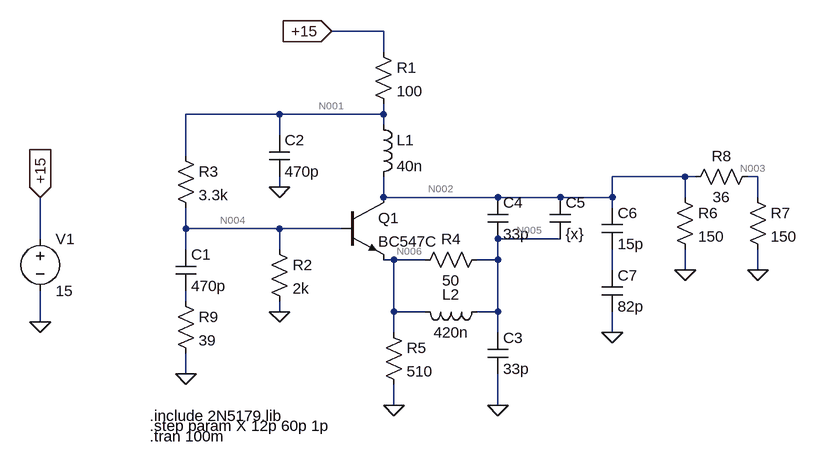
[diagram p0: schematic 2ndmixer-2ndlo.asc]
2ndmixer-2ndlo.asc, the LTspice schematic file:
Version 4
SHEET 1 880 680
WIRE 128 -144 48 -144
WIRE 128 -112 128 -144
WIRE -32 -16 -176 -16
WIRE 128 -16 128 -32
WIRE 128 -16 -32 -16
WIRE 128 0 128 -16
WIRE -32 16 -32 -16
WIRE -176 48 -176 -16
WIRE 592 80 480 80
WIRE 608 80 592 80
WIRE 704 80 688 80
WIRE -32 96 -32 80
WIRE 128 112 128 80
WIRE 304 112 128 112
WIRE 400 112 304 112
WIRE 480 112 480 80
WIRE 480 112 400 112
WIRE 592 112 592 80
WIRE 704 112 704 80
WIRE 480 128 480 112
WIRE -176 160 -176 128
WIRE -32 160 -176 160
WIRE 64 160 -32 160
WIRE -400 176 -400 112
WIRE 400 176 304 176
WIRE -176 192 -176 160
WIRE -32 192 -32 160
WIRE 144 208 128 208
WIRE 192 208 144 208
WIRE 304 208 304 176
WIRE 304 208 272 208
WIRE 480 224 480 192
WIRE 592 224 592 192
WIRE 704 224 704 192
WIRE -176 272 -176 256
WIRE -32 288 -32 272
WIRE 144 288 144 208
WIRE 192 288 144 288
WIRE 304 288 304 208
WIRE 304 288 272 288
WIRE -400 304 -400 256
WIRE 144 320 144 288
WIRE 304 320 304 288
WIRE 480 320 480 288
WIRE -176 384 -176 352
WIRE 144 432 144 400
WIRE 304 432 304 384
FLAG 48 -144 +15
IOPIN 48 -144 In
FLAG -400 112 +15
IOPIN -400 112 In
FLAG -400 304 0
FLAG -32 288 0
FLAG 144 432 0
FLAG 304 432 0
FLAG 480 320 0
FLAG -32 96 0
FLAG 592 224 0
FLAG 704 224 0
FLAG -176 384 0
SYMBOL npn 64 112 R0
SYMATTR InstName Q1
SYMATTR Value BC547C
SYMBOL ind 112 -16 R0
SYMATTR InstName L1
SYMATTR Value 40n
SYMBOL res 112 -128 R0
SYMATTR InstName R1
SYMATTR Value 100
SYMBOL voltage -400 160 R0
WINDOW 123 0 0 Left 0
WINDOW 39 0 0 Left 0
SYMATTR InstName V1
SYMATTR Value 15
SYMBOL res -48 176 R0
SYMATTR InstName R2
SYMATTR Value 2k
SYMBOL res -192 32 R0
SYMATTR InstName R3
SYMATTR Value 3.3k
SYMBOL cap -192 192 R0
SYMATTR InstName C1
SYMATTR Value 470p
SYMBOL cap -48 16 R0
SYMATTR InstName C2
SYMATTR Value 470p
SYMBOL ind 288 272 R90
WINDOW 0 5 56 VBottom 2
WINDOW 3 32 56 VTop 2
SYMATTR InstName L2
SYMATTR Value 420n
SYMBOL res 128 304 R0
SYMATTR InstName R5
SYMATTR Value 510
SYMBOL cap 288 320 R0
SYMATTR InstName C3
SYMATTR Value 33p
SYMBOL cap 288 112 R0
SYMATTR InstName C4
SYMATTR Value 33p
SYMBOL cap 384 112 R0
SYMATTR InstName C5
SYMATTR Value {x}
SYMBOL cap 464 128 R0
SYMATTR InstName C6
SYMATTR Value 15p
SYMBOL cap 464 224 R0
SYMATTR InstName C7
SYMATTR Value 82p
SYMBOL res 576 96 R0
SYMATTR InstName R6
SYMATTR Value 150
SYMBOL res 688 96 R0
SYMATTR InstName R7
SYMATTR Value 150
SYMBOL res 704 64 R90
WINDOW 0 0 56 VBottom 2
WINDOW 3 32 56 VTop 2
SYMATTR InstName R8
SYMATTR Value 36
SYMBOL res -192 256 R0
SYMATTR InstName R9
SYMATTR Value 39
SYMBOL res 288 192 R90
WINDOW 0 0 56 VBottom 2
WINDOW 3 32 56 VTop 2
SYMATTR InstName R4
SYMATTR Value 50
TEXT -232 448 Left 2 !.include 2N5179.lib
TEXT -232 480 Left 2 !.tran 100m
TEXT -232 464 Left 2 !.step param X 12p 60p 1p

The netlist it stands for:
* 2ndmixer-2ndlo.asc
Q1 N002 N004 N006 0 BC547C
L1 N001 N002 40n
R1 +15 N001 100
V1 +15 0 15
R2 N004 0 2k
R3 N001 N004 3.3k
C1 N004 N008 470p
C2 N001 0 470p
L2 N005 N006 420n
R5 N006 0 510
C3 N005 0 33p
C4 N002 N005 33p
C5 N002 N005 {x}
C6 N002 N007 15p
C7 N007 0 82p
R6 N002 0 150
R7 N003 0 150
R8 N003 N002 36
R9 N008 0 39
R4 N005 N006 50
.model NPN NPN
.model PNP PNP
.lib standard.bjt
.include 2N5179.lib
.tran 100m
.step param X 12p 60p 1p
.backanno
.end

* Results of the author's LTspice run, read from the files saved beside the schematic
* Operating Point (first step), zero values left out:
*   x = 12 p
*   V(n002) = 6.587 V
*   V(n004) = 2.476 V
*   V(n006) = 1.822 V
*   V(n001) = 6.587 V
*   V(+15) = 15 V
*   V(n005) = 1.822 V
*   V(n003) = 5.312 V
*   Ic(Q1) = 3.565 mA
*   Ib(Q1) = 7.42 µA
*   Ie(Q1) = -3.573 mA
*   I(L1) = 82.89 mA
*   I(R8) = -35.41 mA
*   I(R7) = 35.41 mA
*   I(R6) = 43.91 mA
*   I(R5) = 3.573 mA
*   I(R3) = 1.246 mA
*   I(R2) = 1.238 mA
*   I(R1) = 84.13 mA
*   I(V1) = -84.13 mA
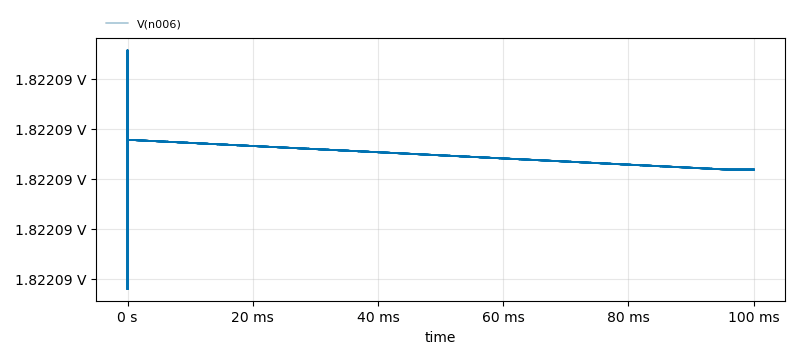
[diagram p1: Transient Analysis of 2ndmixer-2ndlo.asc, plotted from the saved traces]
* Transient Analysis, 49 runs:
*   V(n006) [run 1]: min 1.822 V, max 1.822 V, average 1.822 V, rms 1.822 V, last 1.822 V
*   V(n006) [run 2]: min 1.822 V, max 1.822 V, average 1.822 V, rms 1.822 V, last 1.822 V
*   V(n006) [run 3]: min 1.822 V, max 1.822 V, average 1.822 V, rms 1.822 V, last 1.822 V
*   V(n006) [run 4]: min 1.822 V, max 1.822 V, average 1.822 V, rms 1.822 V, last 1.822 V
*   V(n006) [run 5]: min 1.822 V, max 1.822 V, average 1.822 V, rms 1.822 V, last 1.822 V
*   V(n006) [run 6]: min 1.822 V, max 1.822 V, average 1.822 V, rms 1.822 V, last 1.822 V
*   V(n006) [run 7]: min 1.822 V, max 1.822 V, average 1.822 V, rms 1.822 V, last 1.822 V
*   V(n006) [run 8]: min 1.822 V, max 1.822 V, average 1.822 V, rms 1.822 V, last 1.822 V